# Altium schematic sheet CAN.SchDoc
size 297 x 209 mm
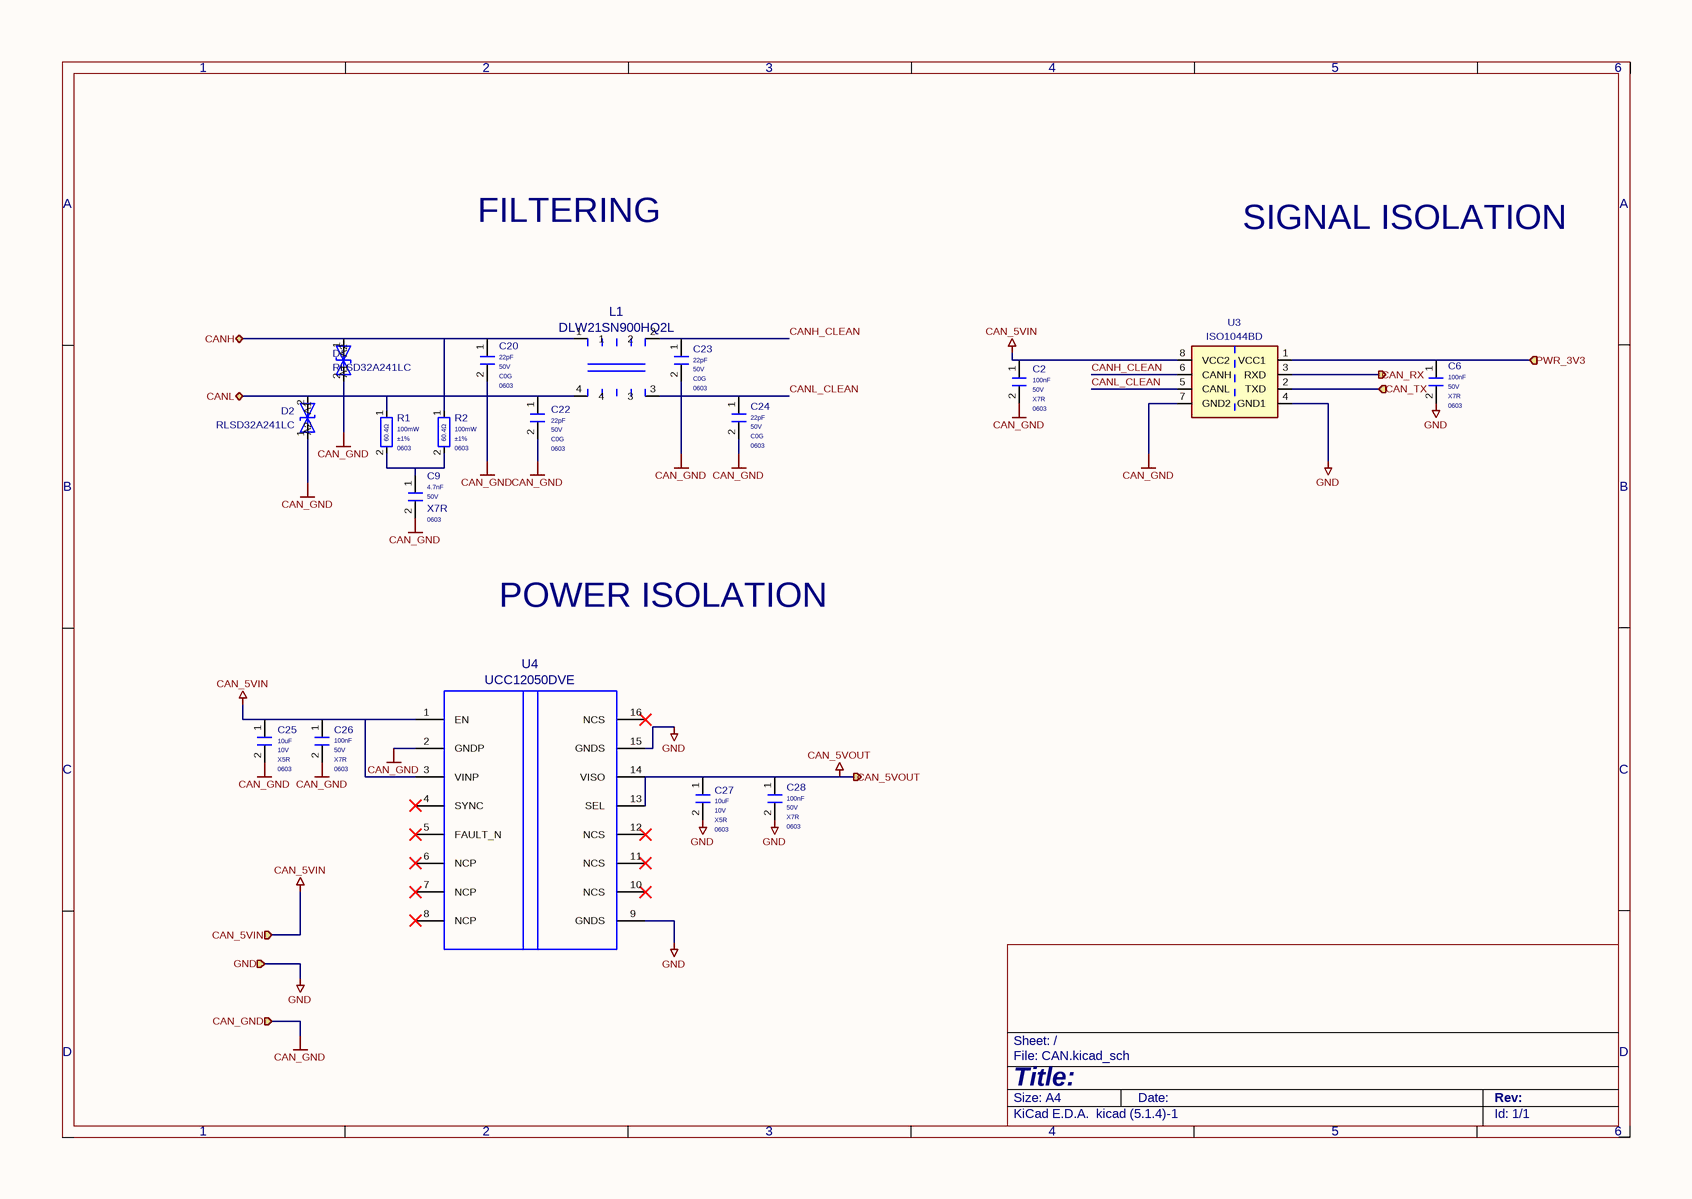
[diagram p0: CAN.SchDoc]

## Parts
C2  Voltage Rated: 50V  Temperature Coefficient: X7R  Package: 0603  [C_0603]  (hidden comment: 100nF)
C6  Voltage Rated: 50V  Temperature Coefficient: X7R  Package: 0603  [C_0603]  (hidden comment: 100nF)
C9  Voltage Rated: 50V  Temperature Coefficient: X7R  Package: 0603  [C_0603]  (hidden comment: 4.7nF)
C20  Voltage Rated: 50V  Temperature Coefficient: C0G  Package: 0603  [C_0603]  (hidden comment: 22pF)
C22  Voltage Rated: 50V  Temperature Coefficient: C0G  Package: 0603  [C_0603]  (hidden comment: 22pF)
C23  Voltage Rated: 50V  Temperature Coefficient: C0G  Package: 0603  [C_0603]  (hidden comment: 22pF)
C24  Voltage Rated: 50V  Temperature Coefficient: C0G  Package: 0603  [C_0603]  (hidden comment: 22pF)
C25  Voltage Rated: 10V  Temperature Coefficient: X5R  Package: 0603  [C_0603]  (hidden comment: 10uF)
C26  Voltage Rated: 50V  Temperature Coefficient: X7R  Package: 0603  [C_0603]  (hidden comment: 100nF)
C27  Voltage Rated: 10V  Temperature Coefficient: X5R  Package: 0603  [C_0603]  (hidden comment: 10uF)
C28  Voltage Rated: 50V  Temperature Coefficient: X7R  Package: 0603  [C_0603]  (hidden comment: 100nF)
D1  RLSD32A241LC  [D_SOD-323]
D2  RLSD32A241LC  [D_SOD-323]
L1  DLW21SN900HQ2L  [IND_DLW21S_0805_MUR]
R1  Power(Watts): 100mW  Tolerance: ±1%  Package: 0603  [R_0603]  (hidden comment: 60.4Ω)
R2  Power(Watts): 100mW  Tolerance: ±1%  Package: 0603  [R_0603]  (hidden comment: 60.4Ω)
U3  ISO1044BD  [SOIC-8_3.9x4.9mm_P1.27mm]
U4  UCC12050DVE  [DVE0016A]

## Ports
CAN_5VIN (in), CAN_5VOUT (out), CAN_GND (in), CAN_RX (out), CAN_TX (in), CANH (bidir), CANL (bidir), GND (in), PWR_3V3 (in)

## Nets
CAN_5VIN: C2.1 C25.1 C26.1 U3.8(VCC2) U4.1(EN) U4.3(VINP) ; port CAN_5VIN
CAN_5VOUT: C27.1 C28.1 U4.13(SEL) U4.14(VISO) ; port CAN_5VOUT
CAN_GND: C2.2 C9.2 C20.2 C22.2 C23.2 C24.2 C25.2 C26.2 D1.2(A2) D2.1(A1) U3.7(GND2) U4.2(GNDP) ; port CAN_GND
GND: C6.2 C27.2 C28.2 U3.4(GND1) U4.9(GNDS) U4.15(GNDS) ; port GND
CAN_RX: U3.3(RXD) ; port CAN_RX
CAN_TX: U3.2(TXD) ; port CAN_TX
CANH: C20.1 D1.1(A1) L1.1 R2.1 ; port CANH
CANH_CLEAN: C23.1 L1.2 U3.6(CANH)
CANL: C22.1 D2.2(A2) L1.4 R1.1 ; port CANL
CANL_CLEAN: C24.1 L1.3 U3.5(CANL)
PWR_3V3: C6.1 U3.1(VCC1) ; port PWR_3V3
NetC9_1: C9.1 R1.2 R2.2

Not connected (* = marked no-connect by the designer): U4 4(SYNC)* 5(FAULT_N)* 6(NCP)* 7(NCP)* 8(NCP)* 10(NCS)* 11(NCS)* 12(NCS)* 16(NCS)*

## Notes on the sheet
- FILTERING
- SIGNAL ISOLATION
- POWER ISOLATION
- 1
- 2
- 3
- 4
- 5
- 6
- A
- B
- C
- D
- Title:
- File: CAN.kicad_sch
- Sheet: /
- KiCad E.D.A.  kicad (5.1.4)-1
- Size: A4
- Date:
- Rev:
- Id: 1/1

## Library data of the parts
C2 C6 C26 C28 = 0603,100nF: Manufacturer: YAGEO; Part: CC0603KRX7R9BB104; Description: 50V 100nF X7R ±10% 0603 Multilayer Ceramic Capacitors MLCC - SMD/SMT ROHS; Process: SMT; Minimum Qty: 20; Attrition Qty: 10; Class: Basic Component; Tolerance: ±10%; LCSC: C14663; Stock: 70324515; Price: 0.006USD; Category: Capacitors,Multilayer Ceramic Capacitors MLCC - SMD/SMT; Capacitance: 100nF; Value: 100nF; Footprint: PCM_JLCPCB:C_0603
C9 = 0603,4.7nF: Manufacturer: FH(Guangdong Fenghua Advanced Tech); Part: 0603B472K500NT; Description: 50V 4.7nF X7R ±10% 0603 Multilayer Ceramic Capacitors MLCC - SMD/SMT ROHS; Process: SMT; Minimum Qty: 20; Attrition Qty: 10; Class: Basic Component; Tolerance: ±10%; LCSC: C53987; Stock: 745383; Price: 0.006USD; Category: Capacitors,Multilayer Ceramic Capacitors MLCC - SMD/SMT; Capacitance: 4.7nF; Value: 4.7nF; Footprint: PCM_JLCPCB:C_0603
C20 C22-C24 = 0603,22pF: Manufacturer: Samsung Electro-Mechanics; Part: CL10C220JB8NNNC; Description: 50V 22pF C0G ±5% 0603 Multilayer Ceramic Capacitors MLCC - SMD/SMT ROHS; Process: SMT; Minimum Qty: 20; Attrition Qty: 10; Class: Basic Component; Tolerance: ±5%; LCSC: C1653; Stock: 1531147; Price: 0.007USD; Category: Capacitors,Multilayer Ceramic Capacitors MLCC - SMD/SMT; Capacitance: 22pF; Value: 22pF; Footprint: PCM_JLCPCB:C_0603
C25 C27 = 0603,10uF: Manufacturer: Samsung Electro-Mechanics; Part: CL10A106KP8NNNC; Description: 10V 10uF X5R ±10% 0603 Multilayer Ceramic Capacitors MLCC - SMD/SMT ROHS; Process: SMT; Minimum Qty: 20; Attrition Qty: 10; Class: Basic Component; Tolerance: ±10%; LCSC: C19702; Stock: 9881407; Price: 0.009USD; Category: Capacitors,Multilayer Ceramic Capacitors MLCC - SMD/SMT; Capacitance: 10uF; Value: 10uF; Footprint: PCM_JLCPCB:C_0603
D1 D2 = D_TVS: Description: Bidirectional transient-voltage-suppression diode; Value: RLSD32A241LC; Footprint: PCM_JLCPCB:D_SOD-323
R1 R2 = 0603,56Ω: Manufacturer: UNI-ROYAL(Uniroyal Elec); Part: 0603WAF560JT5E; Description: 100mW Thick Film Resistors 75V ±1% ±200ppm/°C 56Ω 0603 Chip Resistor - Surface Mount ROHS; Process: SMT; Minimum Qty: 20; Attrition Qty: 10; Class: Preferred Component; Resistance: 56Ω; Overload Voltage (Max): 75V; Temperature Coefficient: ±200ppm/°C; LCSC: C25196; Stock: 115138; Price: 0.004USD; Category: Resistors,Chip Resistor - Surface Mount; Type: Thick Film Resistors; Operating Temperature Range: -55°C~+155°C; Value: 60.4Ω; Footprint: PCM_JLCPCB:R_0603
U3 = ISO1044BD: Description: Isolated CAN FD Transceiver, SOIC-8; Value: ISO1044BD; Footprint: Package_SO:SOIC-8_3.9x4.9mm_P1.27mm
L1 = DLW21SN900HQ2L: Value: DLW21SN900HQ2L; Footprint: DLW21:IND_DLW21S_0805_MUR
U4 = UCC12050DVE: Value: UCC12050DVE; Footprint: UCC12:DVE0016A